# EAGLE schematic power_board1_v1.0 (EAGLE 9.5.1)
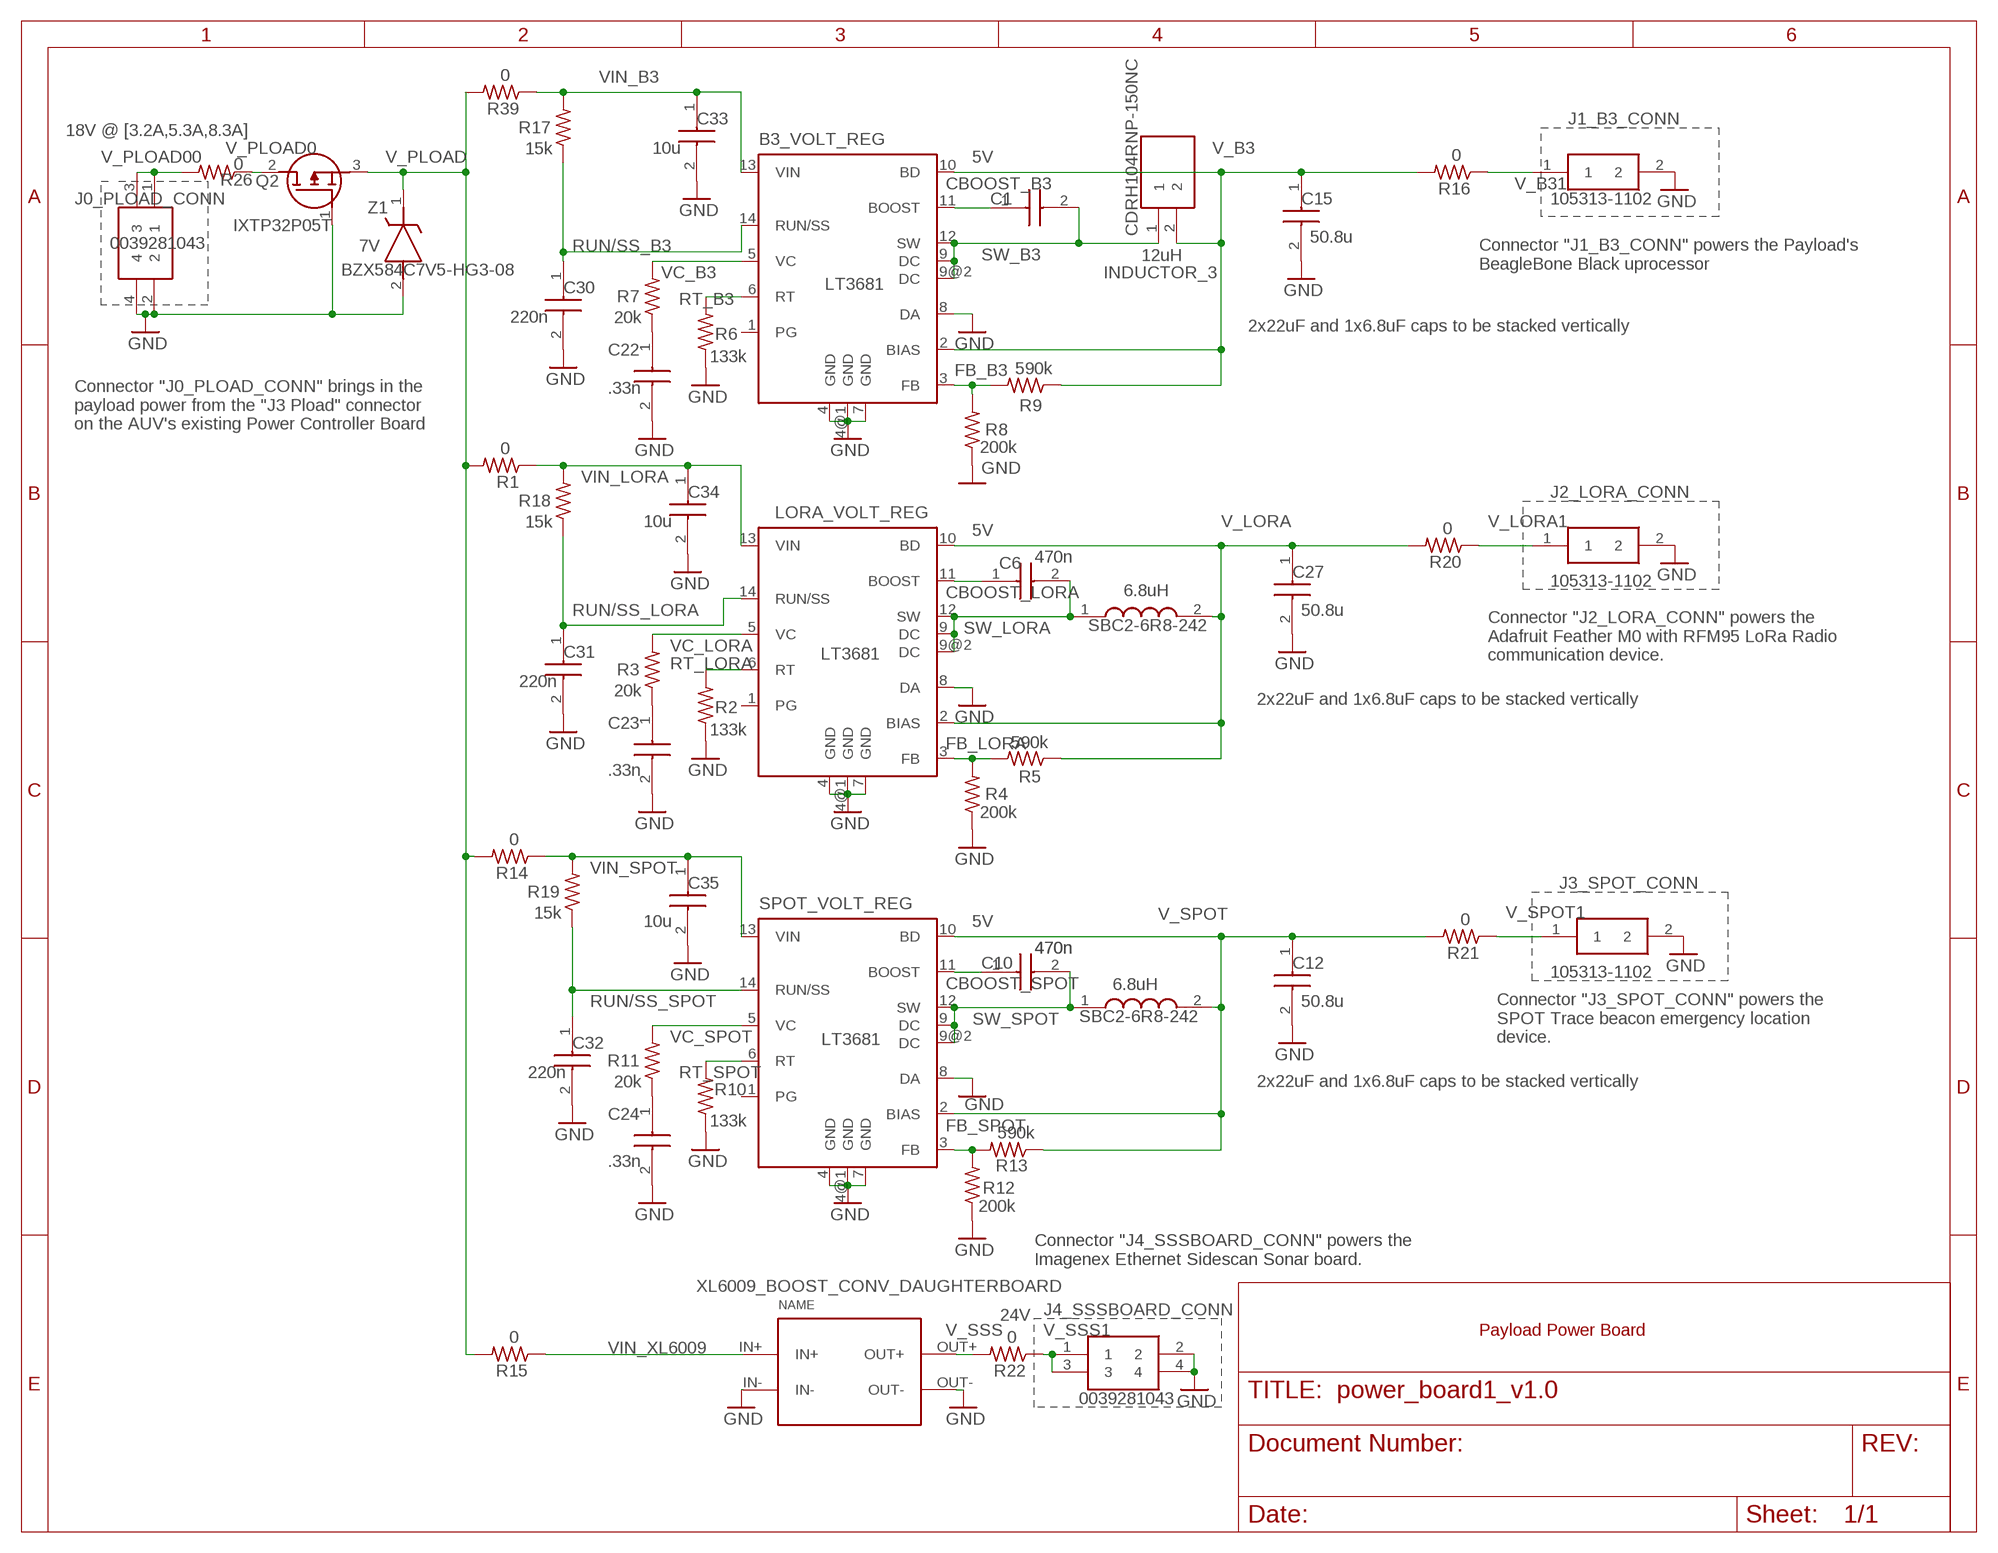
[diagram p0: schematic, sheet 1]

## Parts
B3_VOLT_REG  LT3681  [DFN14-4X3DE]
C1  08053C474KAT2A  [CAPC2012X140N]
C6  08053C474KAT2A  [CAPC2012X140N]
C10  08053C474KAT2A  [CAPC2012X140N]
C12  12103C226KAT2A  [CAPC3225X279N]
C15  12103C226KAT2A  [CAPC3225X279N]
C22  08053C334KAT2A  [CAPC2012X140N]
C23  08053C334KAT2A  [CAPC2012X140N]
C24  08053C334KAT2A  [CAPC2012X140N]
C27  12103C226KAT2A  [CAPC3225X279N]
C30  08051C224KAT2A  [CAPC2012X140N]
C31  08051C224KAT2A  [CAPC2012X140N]
C32  08051C224KAT2A  [CAPC2012X140N]
C33  22201C106KAT2A  [CAPC5750X279N]
C34  22201C106KAT2A  [CAPC5750X279N]
C35  22201C106KAT2A  [CAPC5750X279N]
INDUCTOR_3  CDRH104RNP-150NC  [INDPM102100X400N]
J0_PLOAD_CONN  0039281043  [SHDR4W125P550X420_2X2_960X960X]
J1_B3_CONN  105313-1102  [1053131102]
J2_LORA_CONN  105313-1102  [1053131102]
J3_SPOT_CONN  105313-1102  [1053131102]
J4_SSSBOARD_CONN  0039281043  [SHDR4W125P550X420_2X2_960X960X]
L4  SBC2-6R8-242  [SBC26R8242]
L5  SBC2-6R8-242  [SBC26R8242]
LORA_VOLT_REG  LT3681  [DFN14-4X3DE]
Q2  IXTP32P05T  [TO254P470X1001X2012-3P]
R1  0  R-US_0207/2V  [0207/2V]
R2  133k  R-US_R0805  [R0805]
R3  20k  R-US_R0805  [R0805]
R4  200k  R-US_R0805  [R0805]
R5  590k  R-US_R0805  [R0805]
R6  133k  R-US_R0805  [R0805]
R7  20k  R-US_R0805  [R0805]
R8  200k  R-US_R0805  [R0805]
R9  590k  R-US_R0805  [R0805]
R10  133k  R-US_R0805  [R0805]
R11  20k  R-US_R0805  [R0805]
R12  200k  R-US_R0805  [R0805]
R13  590k  R-US_R0805  [R0805]
R14  0  R-US_0207/2V  [0207/2V]
R15  0  R-US_0207/2V  [0207/2V]
R16  0  R-US_0207/2V  [0207/2V]
R17  15k  R-US_R0805  [R0805]
R18  15k  R-US_R0805  [R0805]
R19  15k  R-US_R0805  [R0805]
R20  0  R-US_0207/2V  [0207/2V]
R21  0  R-US_0207/2V  [0207/2V]
R22  0  R-US_0207/2V  [0207/2V]
R26  0  R-US_0207/2V  [0207/2V]
R39  0  R-US_0207/2V  [0207/2V]
SPOT_VOLT_REG  LT3681  [DFN14-4X3DE]
XL6009_BOOST_CONV_DAUGHTERBOARD  CP8-ADJ  [CP8-ADJ]
Z1  BZX584C7V5-HG3-08  [SODFL1608X75N]

## Nets
CBOOST_B3: B3_VOLT_REG.11(BOOST) C1.1
CBOOST_LORA: C6.1 LORA_VOLT_REG.11(BOOST)
CBOOST_SPOT: C10.1 SPOT_VOLT_REG.11(BOOST)
FB_B3: B3_VOLT_REG.3(FB) R8.2 R9.2
FB_LORA: LORA_VOLT_REG.3(FB) R4.2 R5.2
FB_SPOT: R12.2 R13.2 SPOT_VOLT_REG.3(FB)
GND: B3_VOLT_REG.4(GND) B3_VOLT_REG.4@1(GND) B3_VOLT_REG.7(GND) B3_VOLT_REG.8(DA) C12.2 C15.2 C22.2 C23.2 C24.2 C27.2 C30.2 C31.2 C32.2 C33.2 C34.2 C35.2 J0_PLOAD_CONN.2 J0_PLOAD_CONN.4 J1_B3_CONN.2 J2_LORA_CONN.2 J3_SPOT_CONN.2 J4_SSSBOARD_CONN.2 J4_SSSBOARD_CONN.4 LORA_VOLT_REG.4(GND) LORA_VOLT_REG.4@1(GND) LORA_VOLT_REG.7(GND) LORA_VOLT_REG.8(DA) Q2.1(G) R2.1 R4.1 R6.1 R8.1 R10.1 R12.1 SPOT_VOLT_REG.4(GND) SPOT_VOLT_REG.4@1(GND) SPOT_VOLT_REG.7(GND) SPOT_VOLT_REG.8(DA) XL6009_BOOST_CONV_DAUGHTERBOARD.IN- XL6009_BOOST_CONV_DAUGHTERBOARD.OUT- Z1.2(A)
N$1: C22.1 R7.1
N$2: C23.1 R3.1
N$4: C24.1 R11.1
RT_B3: B3_VOLT_REG.6(RT) R6.2
RT_LORA: LORA_VOLT_REG.6(RT) R2.2
RT_SPOT: R10.2 SPOT_VOLT_REG.6(RT)
RUN/SS_B3: B3_VOLT_REG.14(RUN/SS) C30.1 R17.1
RUN/SS_LORA: C31.1 LORA_VOLT_REG.14(RUN/SS) R18.1
RUN/SS_SPOT: C32.1 R19.1 SPOT_VOLT_REG.14(RUN/SS)
SW_B3: B3_VOLT_REG.9(DC) B3_VOLT_REG.9@2(DC) B3_VOLT_REG.12(SW) C1.2 INDUCTOR_3.1
SW_LORA: C6.2 L5.1 LORA_VOLT_REG.9(DC) LORA_VOLT_REG.9@2(DC) LORA_VOLT_REG.12(SW)
SW_SPOT: C10.2 L4.1 SPOT_VOLT_REG.9(DC) SPOT_VOLT_REG.9@2(DC) SPOT_VOLT_REG.12(SW)
V_B3: B3_VOLT_REG.2(BIAS) B3_VOLT_REG.10(BD) C15.1 INDUCTOR_3.2 R9.1 R16.2
V_B31: J1_B3_CONN.1 R16.1
V_LORA: C27.1 L5.2 LORA_VOLT_REG.2(BIAS) LORA_VOLT_REG.10(BD) R5.1 R20.2
V_LORA1: J2_LORA_CONN.1 R20.1
V_PLOAD: Q2.3(S) R1.2 R14.2 R15.2 R39.2 Z1.1(K)
V_PLOAD0: Q2.2(D) R26.1
V_PLOAD00: J0_PLOAD_CONN.1 J0_PLOAD_CONN.3 R26.2
V_SPOT: C12.1 L4.2 R13.1 R21.2 SPOT_VOLT_REG.2(BIAS) SPOT_VOLT_REG.10(BD)
V_SPOT1: J3_SPOT_CONN.1 R21.1
V_SSS: R22.2 XL6009_BOOST_CONV_DAUGHTERBOARD.OUT+
V_SSS1: J4_SSSBOARD_CONN.1 J4_SSSBOARD_CONN.3 R22.1
VC_B3: B3_VOLT_REG.5(VC) R7.2
VC_LORA: LORA_VOLT_REG.5(VC) R3.2
VC_SPOT: R11.2 SPOT_VOLT_REG.5(VC)
VIN_B3: B3_VOLT_REG.13(VIN) C33.1 R17.2 R39.1
VIN_LORA: C34.1 LORA_VOLT_REG.13(VIN) R1.1 R18.2
VIN_SPOT: C35.1 R14.1 R19.2 SPOT_VOLT_REG.13(VIN)
VIN_XL6009: R15.1 XL6009_BOOST_CONV_DAUGHTERBOARD.IN+
Unconnected: B3_VOLT_REG.1(PG) LORA_VOLT_REG.1(PG) SPOT_VOLT_REG.1(PG)

## Notes on the sheet
- 18V @ [3.2A,5.3A,8.3A]
- 10u
- 5V
- 50.8u
- 7V
- 12uH
- Connector "J1_B3_CONN" powers the Payload's
  BeagleBone Black uprocessor
- 220n
- 2x22uF and 1x6.8uF caps to be stacked vertically
- .33n
- Connector "J0_PLOAD_CONN" brings in the 
  payload power from the "J3 Pload" connector 
  on the AUV's existing Power Controller Board
- 10u
- 5V
- 470n
- 6.8uH
- 50.8u
- Connector "J2_LORA_CONN" powers the 
  Adafruit Feather M0 with RFM95 LoRa Radio
  communication device.
- 220n
- 2x22uF and 1x6.8uF caps to be stacked vertically
- .33n
- 10u | 5V
- 470n | 470n
- 6.8uH
- 50.8u
- Connector "J3_SPOT_CONN" powers the 
  SPOT Trace beacon emergency location
  device.
- 220n
- 2x22uF and 1x6.8uF caps to be stacked vertically
- .33n
- Connector "J4_SSSBOARD_CONN" powers the 
  Imagenex Ethernet Sidescan Sonar board.
- XL6009_BOOST_CONV_DAUGHTERBOARD
- 24V
- Payload Power Board

## Library data of the parts
B3_VOLT_REG LORA_VOLT_REG SPOT_VOLT_REG = linear-technology:LT3681: 36V, 2A, 2.8MHz Step-Down Switching Regulator with Integrated Power Schottky Diode Source: http://www.linear.com/pc/downloadDocument.do?navId=H0,C1,C1003,C1042,C1032,C1064,P38040,D25144; MPN: LT3681EDE#PBF; OC_FARNELL: 1627603; OC_NEWARK: 57M8550
C1 C6 C10 = 08053C474KAT2A:08053C474KAT2A: AVX - 08053C474KAT2A - CAP, MLCC, X7R, 470NF, 25V, 0805 Source: Datasheet <http://www.mouser.com/ds/2/40/X7RDielectric-777024.pdf>; DESCRIPTION: AVX - 08053C474KAT2A - CAP, MLCC, X7R, 470NF, 25V, 0805; HEIGHT: 1.4mm; MANUFACTURER_NAME: AVX; MANUFACTURER_PART_NUMBER: 08053C474KAT2A; MOUSER_PART_NUMBER: 581-08053C474KAT2A; MOUSER_PRICE-STOCK: https://www.mouser.com/Search/Refine.aspx?Keyword=581-08053C474KAT2A; RS_PART_NUMBER: 1747389; RS_PRICE-STOCK: http://uk.rs-online.com/web/p/products/1747389
C12 C15 C27 = 12103C226KAT2A:12103C226KAT2A: Multilayer Ceramic Capacitors MLCC - SMD/SMT 25V 22uF X7R 1210 0.1 Source: Datasheet <https://componentsearchengine.com/Datasheets/1/12103C226KAT2A.pdf>; DESCRIPTION: Multilayer Ceramic Capacitors MLCC - SMD/SMT 25V 22uF X7R 1210 0.1; HEIGHT: 2.79mm; MANUFACTURER_NAME: AVX; MANUFACTURER_PART_NUMBER: 12103C226KAT2A; MOUSER_PART_NUMBER: 581-12103C226KAT2A; MOUSER_PRICE-STOCK: https://www.mouser.com/Search/Refine.aspx?Keyword=581-12103C226KAT2A
C22-C24 = 08053C334KAT2A:08053C334KAT2A: AVX 0805 Standard 0.33uF Ceramic Multilayer Capacitor, 25 V dc, +125 Source: Datasheet <http://datasheets.avx.com/X7RDielectric.pdf>; DESCRIPTION: AVX 0805 Standard 0.33uF Ceramic Multilayer Capacitor, 25 V dc, +125; HEIGHT: 1.4mm; MANUFACTURER_NAME: AVX; MANUFACTURER_PART_NUMBER: 08053C334KAT2A; MOUSER_PART_NUMBER: 581-08053C334KAT2A; MOUSER_PRICE-STOCK: https://www.mouser.com/Search/Refine.aspx?Keyword=581-08053C334KAT2A; RS_PART_NUMBER: 1747387; RS_PRICE-STOCK: http://uk.rs-online.com/web/p/products/1747387
C30-C32 = 08051C224KAT2A:08051C224KAT2A: Cap Ceramic 0.22uF 100V X7R 10% Pad SMD 0805 125C T/R Source: Datasheet <https://www.mouser.com/datasheet/2/40/X7RDielectric-777024.pdf>; DESCRIPTION: Cap Ceramic 0.22uF 100V X7R 10% Pad SMD 0805 125C T/R; HEIGHT: 1.4mm; MANUFACTURER_NAME: AVX; MANUFACTURER_PART_NUMBER: 08051C224KAT2A; MOUSER_PART_NUMBER: 581-08051C224KAT2A; MOUSER_PRICE-STOCK: https://www.mouser.com/Search/Refine.aspx?Keyword=581-08051C224KAT2A
C33-C35 = 22201C106KAT2A:22201C106KAT2A: Cap Ceramic 10uF 100V X7R 10% Pad SMD 2220 125C T/R Source: Datasheet <https://www.mouser.com/datasheet/2/40/X7RDielectric-777024.pdf>; DESCRIPTION: Cap Ceramic 10uF 100V X7R 10% Pad SMD 2220 125C T/R; HEIGHT: 2.79mm; MANUFACTURER_NAME: AVX; MANUFACTURER_PART_NUMBER: 22201C106KAT2A; MOUSER_PART_NUMBER: 581-22201C106KAT2A; MOUSER_PRICE-STOCK: https://www.mouser.com/Search/Refine.aspx?Keyword=581-22201C106KAT2A
INDUCTOR_3 = CDRH104RNP-150NC:CDRH104RNP-150NC: Fixed Inductors 15uH 3.1A Source: Datasheet <http://products.sumida.com/products/pdf/CDRH104R.pdf>; DESCRIPTION: Fixed Inductors 15uH 3.1A; HEIGHT: 4mm; MANUFACTURER_NAME: Sumida; MANUFACTURER_PART_NUMBER: CDRH104RNP-150NC; MOUSER_PART_NUMBER: 851-CDRH104RNP-150NC; MOUSER_PRICE-STOCK: https://www.mouser.com/Search/Refine.aspx?Keyword=851-CDRH104RNP-150NC
J0_PLOAD_CONN J4_SSSBOARD_CONN = 0039281043:0039281043: Mini-Fit Jr. Vertical Header, 4.20mm Pitch, Dual Row, 4 Circuits, without Snap-in Plastic Peg PCB Lock, Tin, Natural Source: Datasheet <http://www.molex.com/webdocs/datasheets/pdf/en-us//0039281043_PCB_HEADERS.pdf>; DESCRIPTION: Mini-Fit Jr. Vertical Header, 4.20mm Pitch, Dual Row, 4 Circuits, without Snap-in Plastic Peg PCB Lock, Tin, Natural; HEIGHT: 13.1mm; MANUFACTURER_NAME: Molex; MANUFACTURER_PART_NUMBER: 0039281043; MOUSER_PART_NUMBER: N/A; MOUSER_PRICE-STOCK: https://www.mouser.com/Search/Refine.aspx?Keyword=N%2FA
J1_B3_CONN J2_LORA_CONN J3_SPOT_CONN = 105313-1102:105313-1102: Molex Nano-Fit 105313, 2.5mm Pitch, 2 Way, 1 Row, Right Angle PCB Header, Through Hole Source: Datasheet <https://www.molex.com/molex/products/datasheet.jsp?part=active/1053131102_PCB_HEADERS.xml&channel=Products&Lang=en-US>; DESCRIPTION: Molex Nano-Fit 105313, 2.5mm Pitch, 2 Way, 1 Row, Right Angle PCB Header, Through Hole; HEIGHT: 6.84mm; MANUFACTURER_NAME: Molex; MANUFACTURER_PART_NUMBER: 105313-1102; MOUSER_PART_NUMBER: 538-105313-1102; MOUSER_PRICE-STOCK: https://www.mouser.com/Search/Refine.aspx?Keyword=538-105313-1102; RS_PART_NUMBER: 1623686; RS_PRICE-STOCK: http://uk.rs-online.com/web/p/products/1623686
L4 L5 = SBC2-6R8-242:SBC2-6R8-242: Fixed Inductors 6.8uH 20% 2.4A DCR=50mOhms Source: Datasheet <https://www.mouser.com/datasheet/2/212/KEM_L9007_SBC-1102894.pdf>; DESCRIPTION: Fixed Inductors 6.8uH 20% 2.4A DCR=50mOhms; HEIGHT: 8mm; MANUFACTURER_NAME: Kemet; MANUFACTURER_PART_NUMBER: SBC2-6R8-242; MOUSER_PART_NUMBER: 80-SBC2-6R8-242; MOUSER_PRICE-STOCK: https://www.mouser.com/Search/Refine.aspx?Keyword=80-SBC2-6R8-242
Q2 = IXTP32P05T:IXTP32P05T: MOSFET 32 Amps 50V 0.036 Rds Source: Datasheet <https://m.littelfuse.com/~/media/electronics/datasheets/discrete_mosfets/littelfuse_discrete_mosfets_p-channel_ixt_32p05t_datasheet.pdf.pdf>; DESCRIPTION: MOSFET 32 Amps 50V 0.036 Rds; HEIGHT: 4.699mm; MANUFACTURER_NAME: IXYS SEMICONDUCTOR; MANUFACTURER_PART_NUMBER: IXTP32P05T; MOUSER_PART_NUMBER: 747-IXTP32P05T; MOUSER_PRICE-STOCK: https://www.mouser.com/Search/Refine.aspx?Keyword=747-IXTP32P05T
R1 R14-R16 R20-R22 R26 R39 = rcl:R-US_: RESISTOR, American symbol; DESC: RES SMD 10K OHM 1% 1/8W 0805; MFR: Yageo; MPN: RC0805FR-0710KL; SPICEPREFIX: R
R2-R13 R17-R19 = rcl:R-US_: RESISTOR, American symbol; SPICEPREFIX: R
XL6009_BOOST_CONV_DAUGHTERBOARD = userlib:CP8-ADJ: Voltage regulator IN: 7-35V OUT: ADJ
Z1 = BZX584C7V5-HG3-08:BZX584C7V5-HG3-08: Zener Diodes 300mW SOD-523 7.5V Small Signal Source: Datasheet <https://www.vishay.com/docs/85793/bzx584c-series.pdf>; DESCRIPTION: Zener Diodes 300mW SOD-523 7.5V Small Signal; HEIGHT: 0.75mm; MANUFACTURER_NAME: Vishay; MANUFACTURER_PART_NUMBER: BZX584C7V5-HG3-08; MOUSER_PART_NUMBER: 78-BZX584C7V5-HG3-08; MOUSER_PRICE-STOCK: https://www.mouser.com/Search/Refine.aspx?Keyword=78-BZX584C7V5-HG3-08